# EAGLE design JTAG (EAGLE 9.6.2)
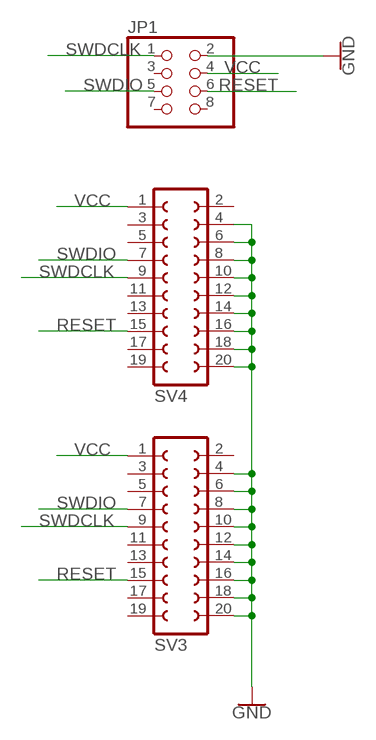
[diagram p0: schematic, sheet 1]

## Parts
JP1  PINHD-2X4  [2X04]
SV3  FE10-2  [FE10-2]
SV4  FE10-2  [FE10-2]

## Nets
GND: JP1.2 SV3.4 SV3.6 SV3.8 SV3.10 SV3.12 SV3.14 SV3.16 SV3.18 SV3.20 SV4.4 SV4.6 SV4.8 SV4.10 SV4.12 SV4.14 SV4.16 SV4.18 SV4.20
RESET: JP1.6 SV3.15 SV4.15
SWDCLK: JP1.1 SV3.9 SV4.9
SWDIO: JP1.5 SV3.7 SV4.7
VCC: JP1.4 SV3.1 SV4.1
Unconnected: JP1.3 JP1.7 JP1.8 SV3.2 SV3.3 SV3.5 SV3.11 SV3.13 SV3.17 SV3.19 SV4.2 SV4.3 SV4.5 SV4.11 SV4.13 SV4.17 SV4.19

## Library data of the parts
JP1 = adafruit:PINHD-2X4: PIN HEADER
SV3 SV4 = con-lsta:FE10-2: FEMALE HEADER; OC_FARNELL: unknown; OC_NEWARK: unknown

## Board
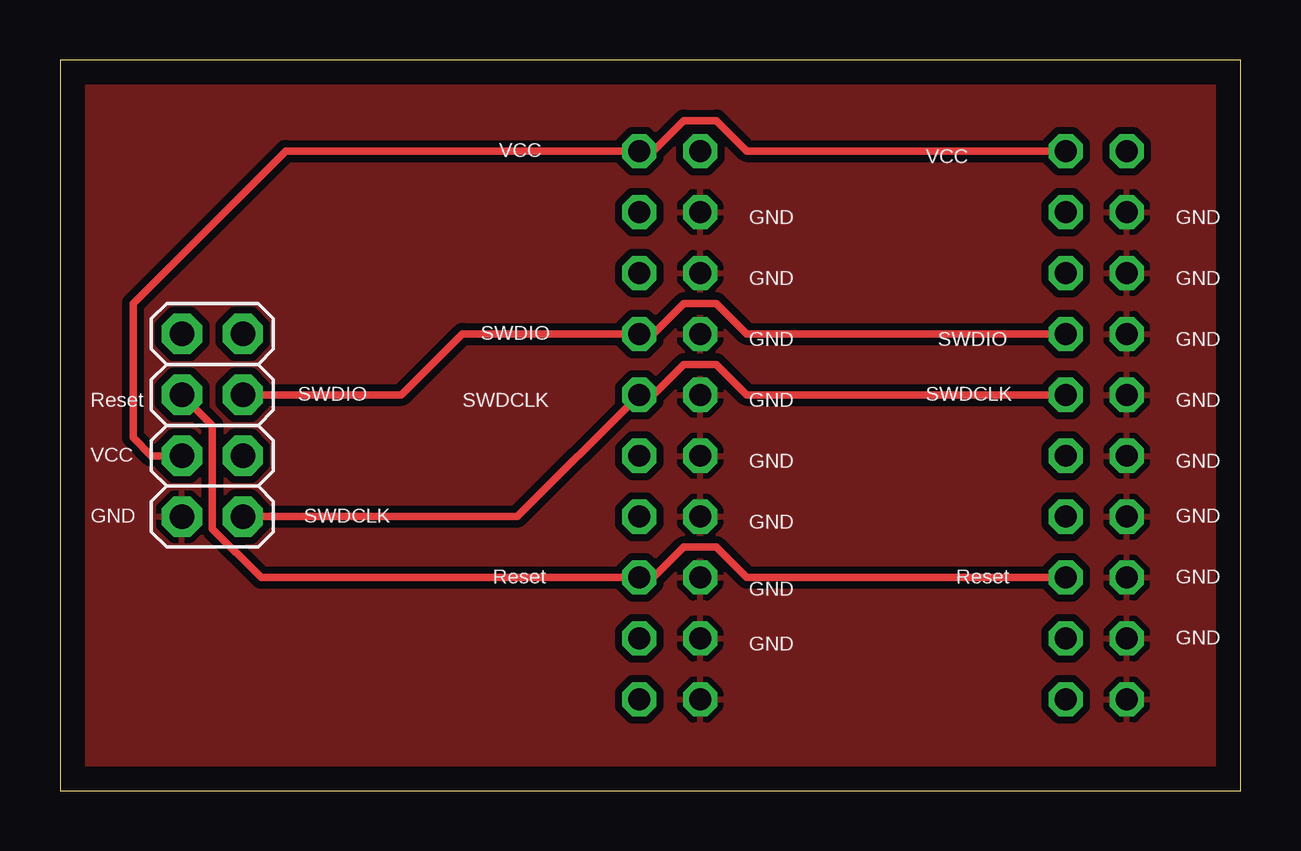
[diagram p1: board, top side]
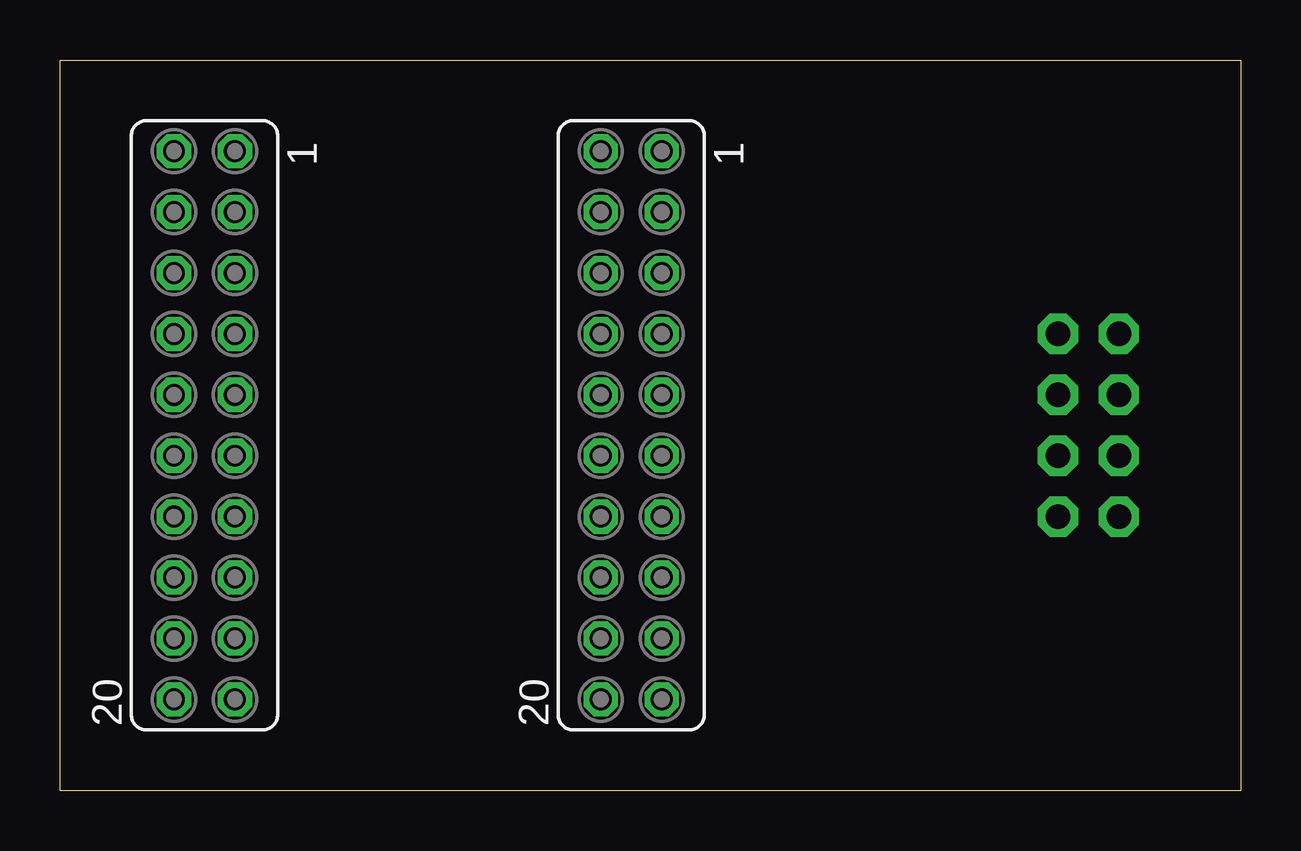
[diagram p2: board, bottom side, seen from below]

Size 49.2 x 30.47 mm. Coordinates in mm from the lower left corner, seen from the top.
Outline: 0,0 49.2,0 49.2,30.47 0,30.47 0,0
Copper layers (1*16): Top 0.035mm / dielectric 1.5mm / Bottom 0.035mm
Design rules "default": minimum track width 6mil, minimum drill 0.35mm, track to track 6mil, track to pad 6mil, pad to pad 6mil, via to via 6mil, smd to smd 6mil, copper to edge 40mil, drill to drill 6mil, minimum pad ring 10mil, minimum via ring 8mil, stop-mask expansion 4mil, vias tented up to drill 0mil, thermal gap 10mil

### Footprints (pad centres in the part's own frame; a part is rotated, then mirrored left to right if it is on the bottom)
2X04 = drill 1.016 pad 1.676 octagon: 1 -3.81,-1.27; 2 -3.81,1.27; 3 -1.27,-1.27; 4 -1.27,1.27; 5 1.27,-1.27; 6 1.27,1.27; 7 3.81,-1.27; 8 3.81,1.27
FE10-2 = drill 0.914 octagon: 1 -11.43,1.27; 2 -11.43,-1.27; 3 -8.89,1.27; 4 -8.89,-1.27; 5 -6.35,1.27; 6 -6.35,-1.27; 7 -3.81,1.27; 8 -3.81,-1.27; 9 -1.27,1.27; 10 -1.27,-1.27; 11 1.27,1.27; 12 1.27,-1.27; 13 3.81,1.27; 14 3.81,-1.27; 15 6.35,1.27; 16 6.35,-1.27; 17 8.89,1.27; 18 8.89,-1.27; 19 11.43,1.27; 20 11.43,-1.27

### Placement (x,y rotation side)
JP1  6.35,15.24 90 top
SV3  25.4,15.24 270 bottom
SV4  43.18,15.24 270 bottom

### Tracks (layer width: path | path; a pad name or v marks a point on that pad's centre or on a via)
GND
  pour Top (isolate 0.305): 0.51,29.72 0.51,0.51 48.77,0.51 48.77,29.72
RESET
  Top 0.305: JP1.6 6.35,15.24 6.35,10.92 8.38,8.89 SV3.15 24.73,8.89 25.99,10.16 27.34,10.16 28.62,8.89 SV4.15
SWDCLK
  Top 0.305: JP1.1 19.05,11.43 SV3.9 24.73,16.51 25.99,17.78 27.34,17.78 28.62,16.51 SV4.9
SWDIO
  Top 0.305: JP1.5 14.22,16.51 16.76,19.05 SV3.7 24.73,19.05 25.99,20.32 27.34,20.32 28.62,19.05 SV4.7
VCC
  Top 0.305: JP1.4 3.81,13.97 3.05,14.73 3.05,20.32 9.4,26.67 SV3.1 24.73,26.67 25.99,27.94 27.34,27.94 28.62,26.67 SV4.1

### Text on the board
tNames: VCC | VCC | GND | GND | GND | GND | SWDIO | GND | SWDIO | GND | Reset | SWDIO | SWDCLK | GND | SWDCLK | GND | VCC | GND | GND | GND | SWDCLK | GND | GND | Reset | Reset | GND | GND | GND | GND